# Altium schematic sheet Header.SchDoc
size A4
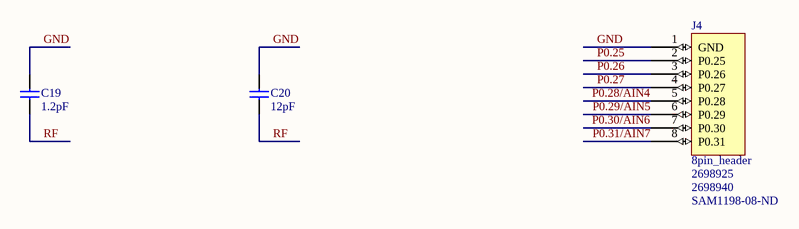
[diagram p0: Header.SchDoc]

## Parts
C19  1.2pF  [CAPC1005X04L]
C20  12pF  [CAPC1005X04L]
J4  8pin_header  Supplier Part Number 1: 2698925  Supplier Part Number 2: 2698940  Supplier Part Number 3: SAM1198-08-ND  [SOCKET_1x8_SMD]

## Nets
GND: C19.2 C20.2 J4.1(GND)
P0.25: J4.2(P0.25)
P0.26: J4.3(P0.26)
P0.27: J4.4(P0.27)
P0.28/AIN4: J4.5(P0.28)
P0.29/AIN5: J4.6(P0.29)
P0.30/AIN6: J4.7(P0.30)
P0.31/AIN7: J4.8(P0.31)
RF: C19.1 C20.1

## Library data of the parts
C19 C20 = CAP: Capacitor, NP0, ±2%; Part Number: C0402-12p; Note: 50V; Artikkelnr Noca: 20029159; Artikkelnr Simpro: N.A.; Manufacturer: *; Manufacturer Part Number: *; Datasheet: *; LatestRevisionDate: 2011-05-11; Pin Count: 2; Publisher: Nordic Semiconductor; Published: 2009-05-08; Supplier: *; Supplier part number: *; 2nd source Supplier: *; 2nd source part number: *; Footprint Doc: 0402
  C19: Value: 1.2pF
  C20: Value: 12pF
J4 = 8pin_header: Supplier 1: Arrow; Supplier 2: Arrow; Supplier 3: Digi-Key